# Altium schematic sheet ADC_part3.SchDoc
size A4
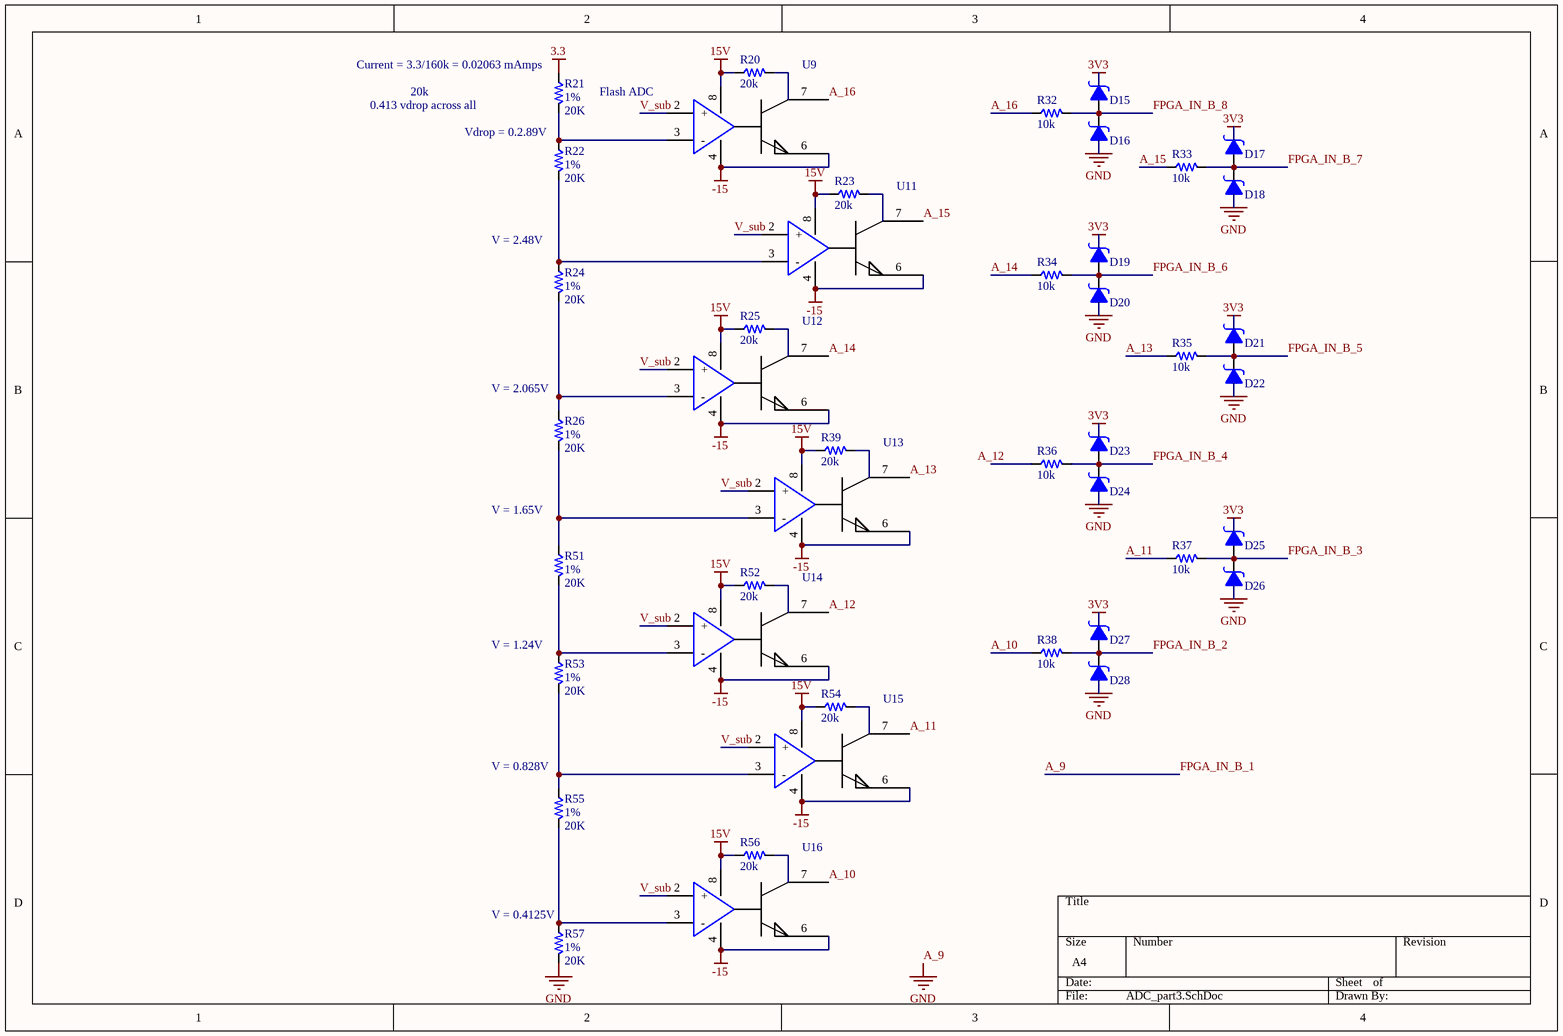
[diagram p0: ADC_part3.SchDoc]

## Parts
D15  ONSEMI_MBRM110LT1G  [ON Semi Schottky Diode - MBRM110LT1G]  (value not drawn)
D16  ONSEMI_MBRM110LT1G  [ON Semi Schottky Diode - MBRM110LT1G]  (value not drawn)
D17  ONSEMI_MBRM110LT1G  [ON Semi Schottky Diode - MBRM110LT1G]  (value not drawn)
D18  ONSEMI_MBRM110LT1G  [ON Semi Schottky Diode - MBRM110LT1G]  (value not drawn)
D19  ONSEMI_MBRM110LT1G  [ON Semi Schottky Diode - MBRM110LT1G]  (value not drawn)
D20  ONSEMI_MBRM110LT1G  [ON Semi Schottky Diode - MBRM110LT1G]  (value not drawn)
D21  ONSEMI_MBRM110LT1G  [ON Semi Schottky Diode - MBRM110LT1G]  (value not drawn)
D22  ONSEMI_MBRM110LT1G  [ON Semi Schottky Diode - MBRM110LT1G]  (value not drawn)
D23  ONSEMI_MBRM110LT1G  [ON Semi Schottky Diode - MBRM110LT1G]  (value not drawn)
D24  ONSEMI_MBRM110LT1G  [ON Semi Schottky Diode - MBRM110LT1G]  (value not drawn)
D25  ONSEMI_MBRM110LT1G  [ON Semi Schottky Diode - MBRM110LT1G]  (value not drawn)
D26  ONSEMI_MBRM110LT1G  [ON Semi Schottky Diode - MBRM110LT1G]  (value not drawn)
D27  ONSEMI_MBRM110LT1G  [ON Semi Schottky Diode - MBRM110LT1G]  (value not drawn)
D28  ONSEMI_MBRM110LT1G  [ON Semi Schottky Diode - MBRM110LT1G]  (value not drawn)
R20  value 20k  [PCB_GENERIC_SMD_0603]  (hidden comment: R060-00101-05)
R21  value 20K  Tolerance: 1%  [PCB_GENERIC_SMD_0603]  (hidden comment: R060-00103-01)
R22  value 20K  Tolerance: 1%  [PCB_GENERIC_SMD_0603]  (hidden comment: R060-00103-01)
R23  value 20k  [PCB_GENERIC_SMD_0603]  (hidden comment: R060-00101-05)
R24  value 20K  Tolerance: 1%  [PCB_GENERIC_SMD_0603]  (hidden comment: R060-00103-01)
R25  value 20k  [PCB_GENERIC_SMD_0603]  (hidden comment: R060-00101-05)
R26  value 20K  Tolerance: 1%  [PCB_GENERIC_SMD_0603]  (hidden comment: R060-00103-01)
R32  value 10k  [PCB_GENERIC_SMD_0603]  (hidden comment: R060-00101-05)
R33  value 10k  [PCB_GENERIC_SMD_0603]  (hidden comment: R060-00101-05)
R34  value 10k  [PCB_GENERIC_SMD_0603]  (hidden comment: R060-00101-05)
R35  value 10k  [PCB_GENERIC_SMD_0603]  (hidden comment: R060-00101-05)
R36  value 10k  [PCB_GENERIC_SMD_0603]  (hidden comment: R060-00101-05)
R37  value 10k  [PCB_GENERIC_SMD_0603]  (hidden comment: R060-00101-05)
R38  value 10k  [PCB_GENERIC_SMD_0603]  (hidden comment: R060-00101-05)
R39  value 20k  [PCB_GENERIC_SMD_0603]  (hidden comment: R060-00101-05)
R51  value 20K  Tolerance: 1%  [PCB_GENERIC_SMD_0603]  (hidden comment: R060-00103-01)
R52  value 20k  [PCB_GENERIC_SMD_0603]  (hidden comment: R060-00101-05)
R53  value 20K  Tolerance: 1%  [PCB_GENERIC_SMD_0603]  (hidden comment: R060-00103-01)
R54  value 20k  [PCB_GENERIC_SMD_0603]  (hidden comment: R060-00101-05)
R55  value 20K  Tolerance: 1%  [PCB_GENERIC_SMD_0603]  (hidden comment: R060-00103-01)
R56  value 20k  [PCB_GENERIC_SMD_0603]  (hidden comment: R060-00101-05)
R57  value 20K  Tolerance: 1%  [PCB_GENERIC_SMD_0603]  (hidden comment: R060-00103-01)
U9  AP331A  [SOT95P285X130-5N]  (value not drawn)
U11  AP331A  [SOT95P285X130-5N]  (value not drawn)
U12  AP331A  [SOT95P285X130-5N]  (value not drawn)
U13  AP331A  [SOT95P285X130-5N]  (value not drawn)
U14  AP331A  [SOT95P285X130-5N]  (value not drawn)
U15  AP331A  [SOT95P285X130-5N]  (value not drawn)
U16  AP331A  [SOT95P285X130-5N]  (value not drawn)

## Nets
3.3: R21.1
3V3: D15.1 D17.1 D19.1 D21.1 D23.1 D25.1 D27.1
15V: R20.1 R23.1 R25.1 R39.1 R52.1 R54.1 R56.1 U9.8(VCC) U11.8(VCC) U12.8(VCC) U13.8(VCC) U14.8(VCC) U15.8(VCC) U16.8(VCC)
-15: U9.4(GND) U9.6 U11.4(GND) U11.6 U12.4(GND) U12.6 U13.4(GND) U13.6 U14.4(GND) U14.6 U15.4(GND) U15.6 U16.4(GND) U16.6
A_9: D16.2 D18.2 D20.2 D22.2 D24.2 D26.2 D28.2 R57.2  [also labelled FPGA_IN_B_1, GND]
A_10: R38.1 U16.7
A_11: R37.1 U15.7
A_12: U14.7
A_13: R35.1 U13.7
A_14: R34.1 U12.7
A_15: R33.1 U11.7
A_16: R32.1 U9.7
FPGA_IN_B_2: D27.2 D28.1 R38.2
FPGA_IN_B_3: D25.2 D26.1 R37.2
FPGA_IN_B_4: D23.2 D24.1 R36.2
FPGA_IN_B_5: D21.2 D22.1 R35.2
FPGA_IN_B_6: D19.2 D20.1 R34.2
FPGA_IN_B_7: D17.2 D18.1 R33.2
FPGA_IN_B_8: D15.2 D16.1 R32.2
V_sub: U9.2(+) U11.2(+) U12.2(+) U13.2(+) U14.2(+) U15.2(+) U16.2(+)
NetR21_2: R21.2 R22.1 U9.3(-)
NetR22_2: R22.2 R24.1 U11.3(-)
NetR24_2: R24.2 R26.1 U12.3(-)
NetR26_2: R26.2 R51.1 U13.3(-)
NetR51_2: R51.2 R53.1 U14.3(-)
NetR53_2: R53.2 R55.1 U15.3(-)
NetR55_2: R55.2 R57.1 U16.3(-)

Not connected (* = marked no-connect by the designer): R20 2; R23 2; R25 2; R36 1; R39 2; R52 2; R54 2; R56 2

## Notes on the sheet
- (near R21) Current = 3.3/160k = 0.02063 mAmps
- 0.413 vdrop across all
- 20k
- Flash ADC
- (near R22) Vdrop = 0.2.89V
- (near R24) V = 2.48V
- (near R26) V = 2.065V
- (near R51) V = 1.65V
- (near R53) V = 1.24V
- (near R55) V = 0.828V
- (near R57) V = 0.4125V
- Labels drawn without touching a wire or pin: A_12

## Library data of the parts
D15-D28 = ONSEMI_MBRM110LT1G: DIODE SCHOTTKY 10V 1A; Supplier 1: Digi-Key; Supplier Part Number 1: MBRM110LT1GOSDKR-ND
R20 R23 R25 R32-R39 R52 R54 R56 = R060-00101-05: RES 0603 100ohm 5% 63mW; Tolerance: 5%; Power: 63mW; Package: 0603
R21 R22 R24 R26 R51 R53 R55 R57 = R060-00103-01: RES 0603 10K 1% 100mW; Power: 100mW; Package: 0603
U9 U11-U16 = AP331A: Single Channel Comparator, Open Drain, SC-74A/SOT-753; Supplier 1: Digikey; Supplier Part Number 1: AP331AWGDICT-ND